# Altium schematic sheet Flujo sobre el electroimán.SchDoc
size A4
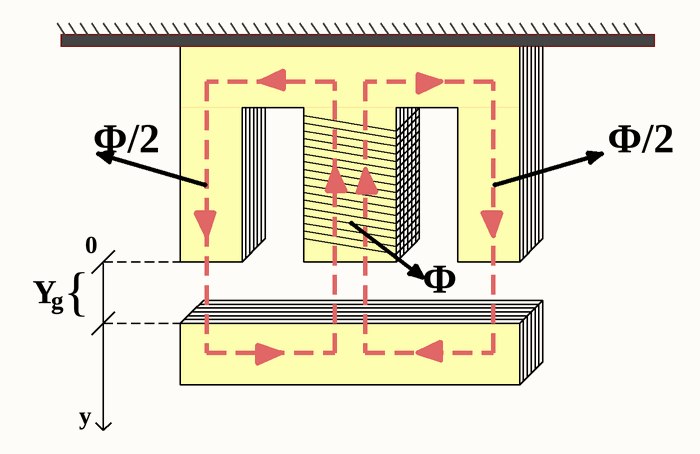
[diagram p0: Flujo sobre el electroimán.SchDoc]

## Notes on the sheet
- Φ/2
- 0
- Y
- g
- {
- Φ
- y